# EAGLE schematic BeatLights (EAGLE 6.3)
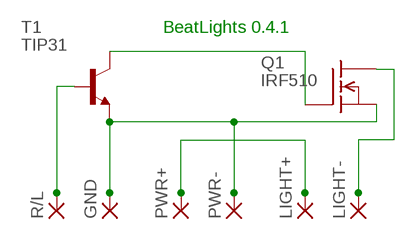
[diagram p0: schematic, sheet 1]

## Parts
GND  1,6/0,8  [1,6/0,8]
LIGHT+  1,6/0,8  [1,6/0,8]
LIGHT-  1,6/0,8  [1,6/0,8]
PWR+  1,6/0,8  [1,6/0,8]
PWR-  1,6/0,8  [1,6/0,8]
Q1  IRF510  [TO220]
R/L  1,6/0,8  [1,6/0,8]
T1  TIP31  [TO220]

## Nets
N$1: R/L.1(P) T1.1(B)
N$2: Q1.1(G) T1.2(C)
N$3: LIGHT-.1(P) Q1.2(D)
N$4: GND.1(P) PWR-.1(P) Q1.3(S) T1.3(E)
N$5: LIGHT+.1(P) PWR+.1(P)

## Notes on the sheet
- BeatLights 0.4.1

## Library data of the parts
GND LIGHT+ LIGHT- PWR+ PWR- R/L = wirepad:1,6/0,8: THROUGH-HOLE PAD
Q1 = transistor-fet:IRF510: N-Channel Enhancement MOSFET (HEXFET); 100V; 5,6A; 0,54Ohm
T1 = transistor:TIP31: NPN Transistor Medium Power Linear Switching Applications Source: http://onsemi.com